# EAGLE design pmi_extension_2k13 (EAGLE 6.4)
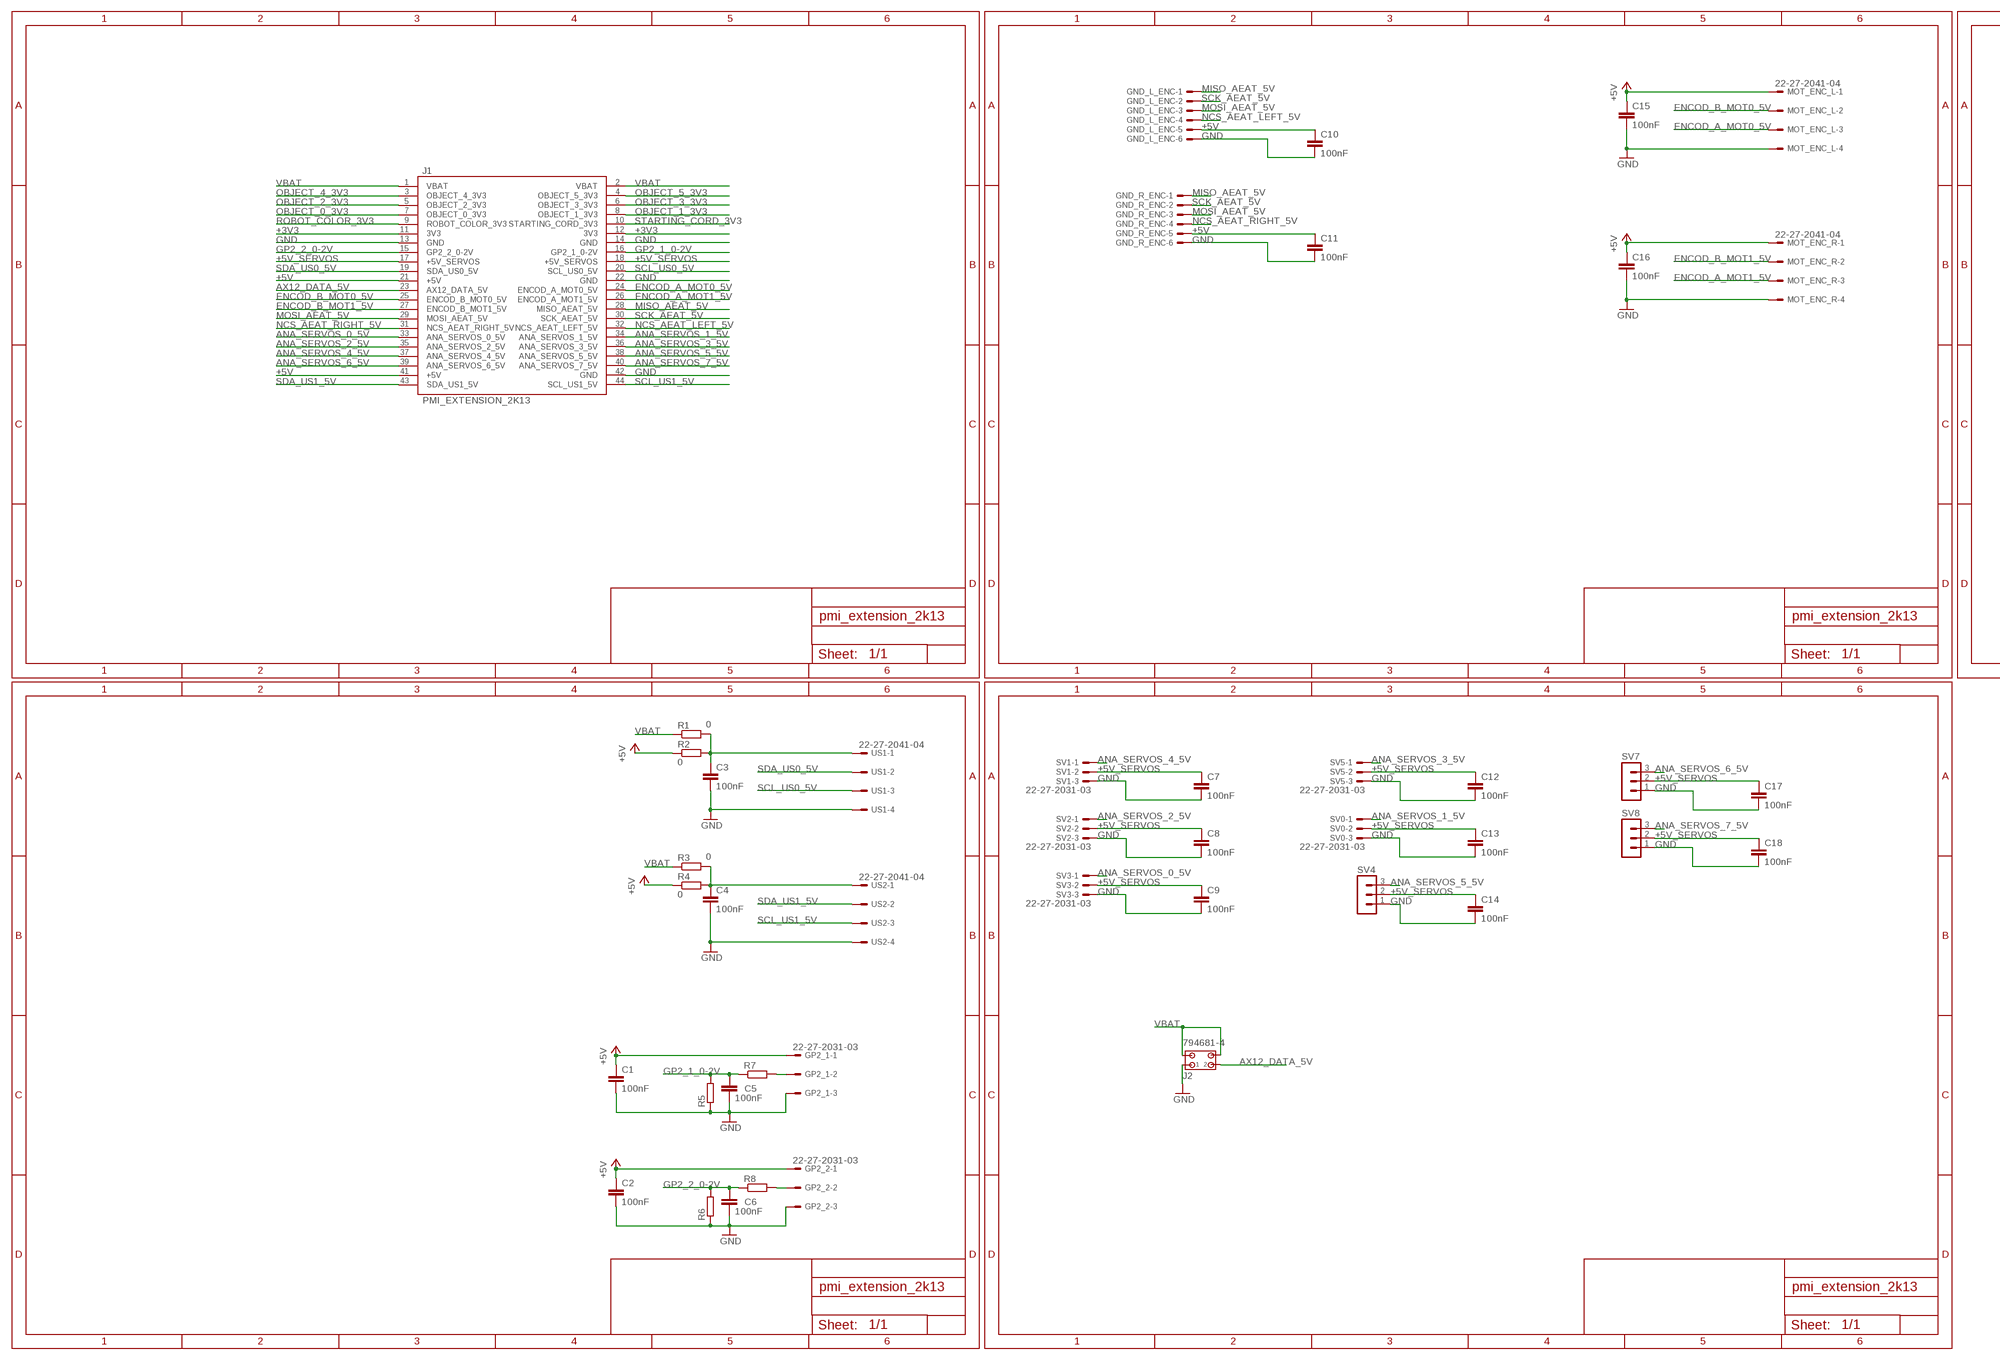
[diagram p0: schematic, sheet 1, part 1 of 2]
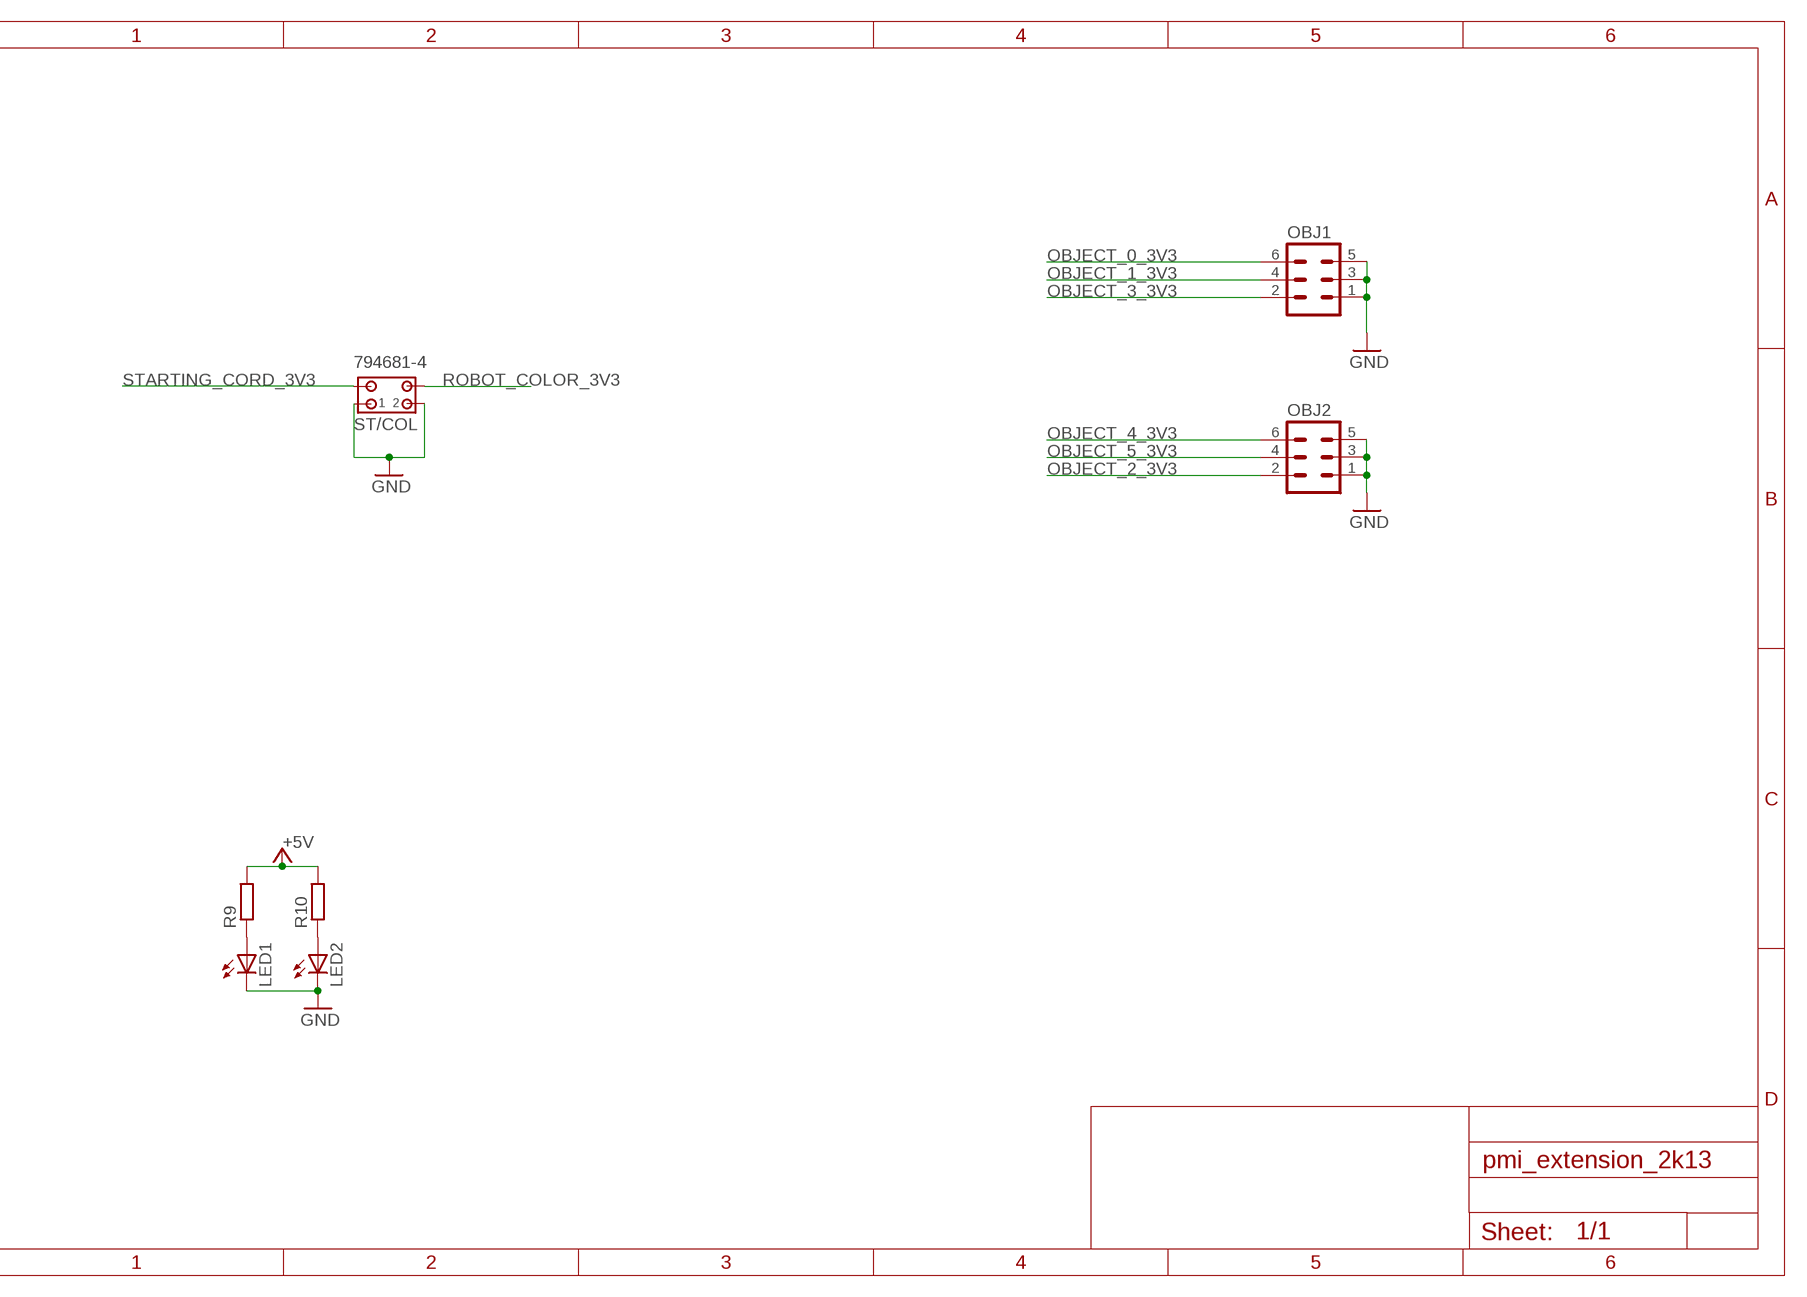
[diagram p1: schematic, sheet 1, part 2 of 2]

## Parts
C1  100nF  C-EUC0603  [C0603]
C2  100nF  C-EUC0603  [C0603]
C3  100nF  C-EUC0603  [C0603]
C4  100nF  C-EUC0603  [C0603]
C5  100nF  C-EUC0603  [C0603]
C6  100nF  C-EUC0603  [C0603]
C7  100nF  C-EUC0805  [C0805]
C8  100nF  C-EUC0805  [C0805]
C9  100nF  C-EUC0805  [C0805]
C10  100nF  C-EUC0603  [C0603]
C11  100nF  C-EUC0603  [C0603]
C12  100nF  C-EUC0805  [C0805]
C13  100nF  C-EUC0805  [C0805]
C14  100nF  C-EUC0603  [C0603]
C15  100nF  C-EUC0603  [C0603]
C16  100nF  C-EUC0603  [C0603]
C17  100nF  C-EUC0603  [C0603]
C18  100nF  C-EUC0603  [C0603]
GND_L_ENC  22-23-2061  [22-23-2061]
GND_R_ENC  22-23-2061  [22-23-2061]
GP2_1  22-27-2031-03  [6410-03]
GP2_2  22-27-2031-03  [6410-03]
J1  PMI_EXTENSION_2K13  [HEADER_2X22]
J2  794681-4  [794681-4]
LED1  LED3MM  [LED3MM]
LED2  LED3MM  [LED3MM]
MOT_ENC_L  22-27-2041-04  [6410-04]
MOT_ENC_R  22-27-2041-04  [6410-04]
OBJ1  MA03-2  [MA03-2]
OBJ2  MA03-2  [MA03-2]
R1  0  R-EU_R0603  [R0603]
R2  0  R-EU_R0603  [R0603]
R3  0  R-EU_R0603  [R0603]
R4  0  R-EU_R0603  [R0603]
R5  R-EU_R0603  [R0603]
R6  R-EU_R0603  [R0603]
R7  R-EU_R0603  [R0603]
R8  R-EU_R0603  [R0603]
R9  R-EU_R0603  [R0603]
R10  R-EU_R0603  [R0603]
ST/COL  794681-4  [794681-4]
SV0  22-27-2031-03  [6410-03]
SV1  22-27-2031-03  [6410-03]
SV2  22-27-2031-03  [6410-03]
SV3  22-27-2031-03  [6410-03]
SV4  MA03-1  [MA03-1]
SV5  22-27-2031-03  [6410-03]
SV7  MA03-1  [MA03-1]
SV8  MA03-1  [MA03-1]
US1  22-27-2041-04  [6410-04]
US2  22-27-2041-04  [6410-04]

## Nets
+3V3: J1.11(3V3) J1.12(3V3)
+5V: C1.1 C2.1 C10.1 C11.1 C15.1 C16.1 GND_L_ENC.5 GND_R_ENC.5 GP2_1.1 GP2_2.1 J1.21(+5V) J1.41(+5V) MOT_ENC_L.1 MOT_ENC_R.1 R2.1 R4.1 R9.2 R10.2
+5V_SERVOS: C7.1 C8.1 C9.1 C12.1 C13.1 C14.1 C17.1 C18.1 J1.17(+5V_SERVOS) J1.18(+5V_SERVOS) SV0.2 SV1.2 SV2.2 SV3.2 SV4.2 SV5.2 SV7.2 SV8.2
ANA_SERVOS_0_5V: J1.33(ANA_SERVOS_0_5V) SV3.1
ANA_SERVOS_1_5V: J1.34(ANA_SERVOS_1_5V) SV0.1
ANA_SERVOS_2_5V: J1.35(ANA_SERVOS_2_5V) SV2.1
ANA_SERVOS_3_5V: J1.36(ANA_SERVOS_3_5V) SV5.1
ANA_SERVOS_4_5V: J1.37(ANA_SERVOS_4_5V) SV1.1
ANA_SERVOS_5_5V: J1.38(ANA_SERVOS_5_5V) SV4.3
ANA_SERVOS_6_5V: J1.39(ANA_SERVOS_6_5V) SV7.3
ANA_SERVOS_7_5V: J1.40(ANA_SERVOS_7_5V) SV8.3
AX12_DATA_5V: J1.23(AX12_DATA_5V) J2.2
ENCOD_A_MOT0_5V: J1.24(ENCOD_A_MOT0_5V) MOT_ENC_L.3
ENCOD_A_MOT1_5V: J1.26(ENCOD_A_MOT1_5V) MOT_ENC_R.3
ENCOD_B_MOT0_5V: J1.25(ENCOD_B_MOT0_5V) MOT_ENC_L.2
ENCOD_B_MOT1_5V: J1.27(ENCOD_B_MOT1_5V) MOT_ENC_R.2
GND: C1.2 C2.2 C3.2 C4.2 C5.2 C6.2 C7.2 C8.2 C9.2 C10.2 C11.2 C12.2 C13.2 C14.2 C15.2 C16.2 C17.2 C18.2 GND_L_ENC.6 GND_R_ENC.6 GP2_1.3 GP2_2.3 J1.13(GND) J1.14(GND) J1.22(GND) J1.42(GND) J2.1 LED1.K(C) LED2.K(C) MOT_ENC_L.4 MOT_ENC_R.4 OBJ1.1 OBJ1.3 OBJ1.5 OBJ2.1 OBJ2.3 OBJ2.5 R5.1 R6.1 ST/COL.1 ST/COL.2 SV0.3 SV1.3 SV2.3 SV3.3 SV4.1 SV5.3 SV7.1 SV8.1 US1.4 US2.4
GP2_1_0-2V: C5.1 J1.16(GP2_1_0-2V) R5.2 R7.1
GP2_2_0-2V: C6.1 J1.15(GP2_2_0-2V) R6.2 R8.1
MISO_AEAT_5V: GND_L_ENC.1 GND_R_ENC.1 J1.28(MISO_AEAT_5V)
MOSI_AEAT_5V: GND_L_ENC.3 GND_R_ENC.3 J1.29(MOSI_AEAT_5V)
N$1: GP2_1.2 R7.2
N$3: GP2_2.2 R8.2
N$4: C4.1 R3.2 R4.2 US2.1
N$5: LED1.A R9.1
N$6: C3.1 R1.2 R2.2 US1.1
N$7: LED2.A R10.1
NCS_AEAT_LEFT_5V: GND_L_ENC.4 J1.32(NCS_AEAT_LEFT_5V)
NCS_AEAT_RIGHT_5V: GND_R_ENC.4 J1.31(NCS_AEAT_RIGHT_5V)
OBJECT_0_3V3: J1.7(OBJECT_0_3V3) OBJ1.6
OBJECT_1_3V3: J1.8(OBJECT_1_3V3) OBJ1.4
OBJECT_2_3V3: J1.5(OBJECT_2_3V3) OBJ2.2
OBJECT_3_3V3: J1.6(OBJECT_3_3V3) OBJ1.2
OBJECT_4_3V3: J1.3(OBJECT_4_3V3) OBJ2.6
OBJECT_5_3V3: J1.4(OBJECT_5_3V3) OBJ2.4
ROBOT_COLOR_3V3: J1.9(ROBOT_COLOR_3V3) ST/COL.4
SCK_AEAT_5V: GND_L_ENC.2 GND_R_ENC.2 J1.30(SCK_AEAT_5V)
SCL_US0_5V: J1.20(SCL_US0_5V) US1.3
SCL_US1_5V: J1.44(SCL_US1_5V) US2.3
SDA_US0_5V: J1.19(SDA_US0_5V) US1.2
SDA_US1_5V: J1.43(SDA_US1_5V) US2.2
STARTING_CORD_3V3: J1.10(STARTING_CORD_3V3) ST/COL.3
VBAT: J1.1(VBAT) J1.2(VBAT) J2.3 J2.4 R1.1 R3.1

## Library data of the parts
C1-C18 = rcl:C-EU: CAPACITOR, European symbol
GND_L_ENC GND_R_ENC = con-molex:22-23-2061: .100" (2.54mm) Center Header - 6 Pin; MF: MOLEX; MPN: 22-23-2061; OC_FARNELL: 1462922; OC_NEWARK: 27C1933
GP2_1 GP2_2 SV0 SV1-SV3 SV5 = con-molex:22-?-03: CONNECTOR wire to board 2.54 mm (.1 inch) pitch header; OC_FARNELL: unknown; OC_NEWARK: unknown
J1 = robotter_connector:PMI_EXTENSION_2K13
J2 ST/COL = con-amp:794681-4: Micro MATE-N-LOK Connectors grid 1.5mm Dual Row Through Hole Vertical Metal Through Hole Holddowns Source: ENG_CD_794681_E.pdf
LED1 LED2 = led:LED: LED OSRAM: - CHIPLED LG R971, LG N971, LY N971, LG Q971, LY Q971, LO R971, LY R971 LH N974, LH R974 LS Q976, LO Q976, LY Q976 LO Q996 - Hyper CHIPLED LW Q18S LB Q993, LB Q99A, LB R99A - SideLED LS A670, LO A670, LY A670, LG A670, LP A670 LB A673, LV A673, LT A673, LW A673 LH A674 LY A675 LS A676, LA A676, LO A676, LY A676, LW A676 LS A679, LY A679, LG A679 - Hyper Micro SIDELED® LS Y876, LA Y876, LO Y876, LY Y876 LT Y87S - SmartLED LW L88C, LW L88S LB L89C, LB L89S, LG L890 LS L89K, LO L89K, LY L89K LS L896, LA L896, LO L896, LY L896 - TOPLED LS T670, LO T670, LY T670, LG T670, LP T670 LSG T670, LSP T670, LSY T670, LOP T670, LYG T670 LG T671, LOG T671, LSG T671 LB T673, LV T673, LT T673, LW T673 LH T674 LS T676, LA T676, LO T676, LY T676, LB T676, LH T676, LSB T676, LW T676 LB T67C, LV T67C, LT T67C, LS T67K, LO T67K, LY T67K, LW E67C LS E67B, LA E67B, LO E67B, LY E67B, LB E67C, LV E67C, LT E67C LW T67C LS T679, LY T679, LG T679 LS T770, LO T770, LY T770, LG T770, LP T770 LB T773, LV T773, LT T773, LW T773 LH T774 LS E675, LA E675, LY E675, LS T675 LS T776, LA T776, LO T776, LY T776, LB T776 LHGB T686 LT T68C, LB T68C - Hyper Mini TOPLED® LB M676 - Mini TOPLED Santana® LG M470 LS M47K, LO M47K, LY M47K Source: http://www.osram.convergy.de LUXEON: - LUMILED® LXK2-PW12-R00, LXK2-PW12-S00, LXK2-PW14-U00, LXK2-PW14-V00 LXK2-PM12-R00, LXK2-PM12-S00, LXK2-PM14-U00 LXK2-PE12-Q00, LXK2-PE12-R00, LXK2-PE12-S00, LXK2-PE14-T00, LXK2-PE14-U00 LXK2-PB12-K00, LXK2-PB12-L00, LXK2-PB12-M00, LXK2-PB14-N00, LXK2-PB14-P00, LXK2-PB14-Q00 LXK2-PR12-L00, LXK2-PR12-M00, LXK2-PR14-Q00, LXK2-PR14-R00 LXK2-PD12-Q00, LXK2-PD12-R00, LXK2-PD12-S00 LXK2-PH12-R00, LXK2-PH12-S00 LXK2-PL12-P00, LXK2-PL12-Q00, LXK2-PL12-R00 Source: www.luxeon.com KINGBRIGHT: KA-3528ASYC Source: www.kingbright.com
MOT_ENC_L MOT_ENC_R US1 US2 = con-molex:22-?-04: CONNECTOR wire to board 2.54 mm (.1 inch) pitch header; OC_FARNELL: unknown; OC_NEWARK: unknown
OBJ1 OBJ2 = con-lstb:MA03-2: PIN HEADER; OC_FARNELL: unknown; OC_NEWARK: unknown
R1-R10 = rcl:R-EU_: RESISTOR, European symbol
SV4 SV7 SV8 = con-lstb:MA03-1: PIN HEADER; OC_FARNELL: unknown; OC_NEWARK: unknown

## Board
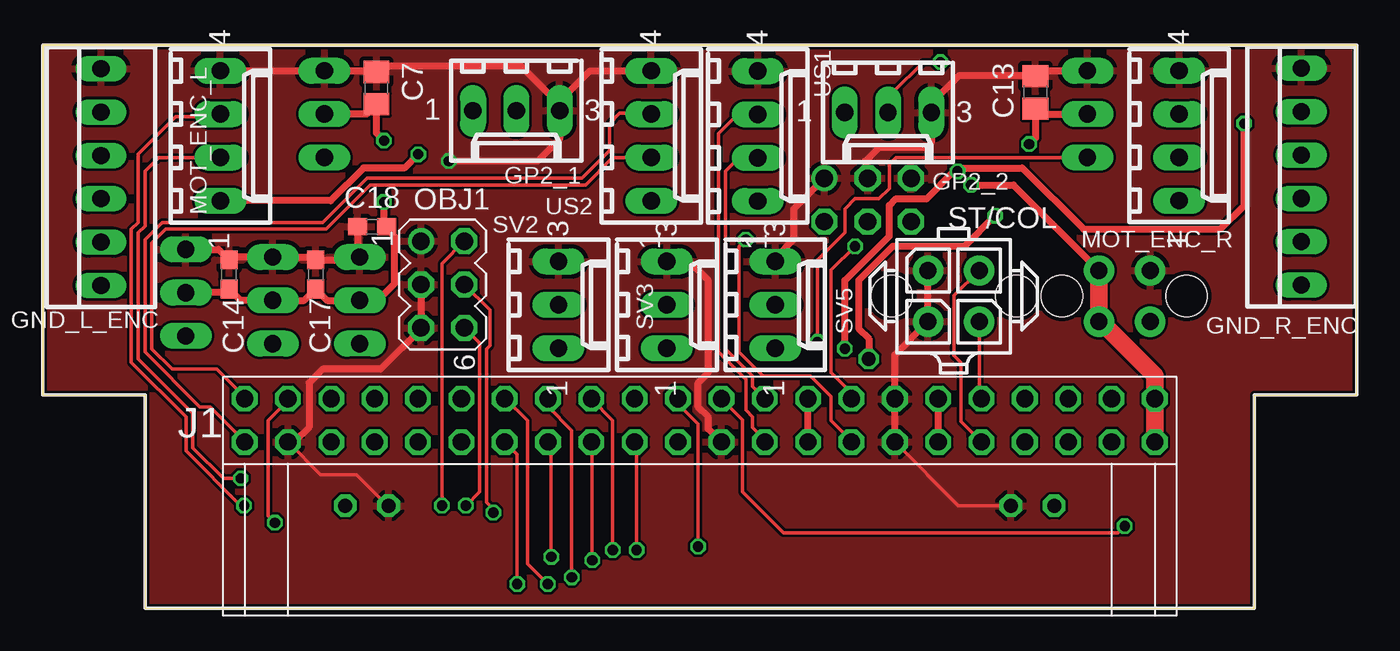
[diagram p2: board, top side]
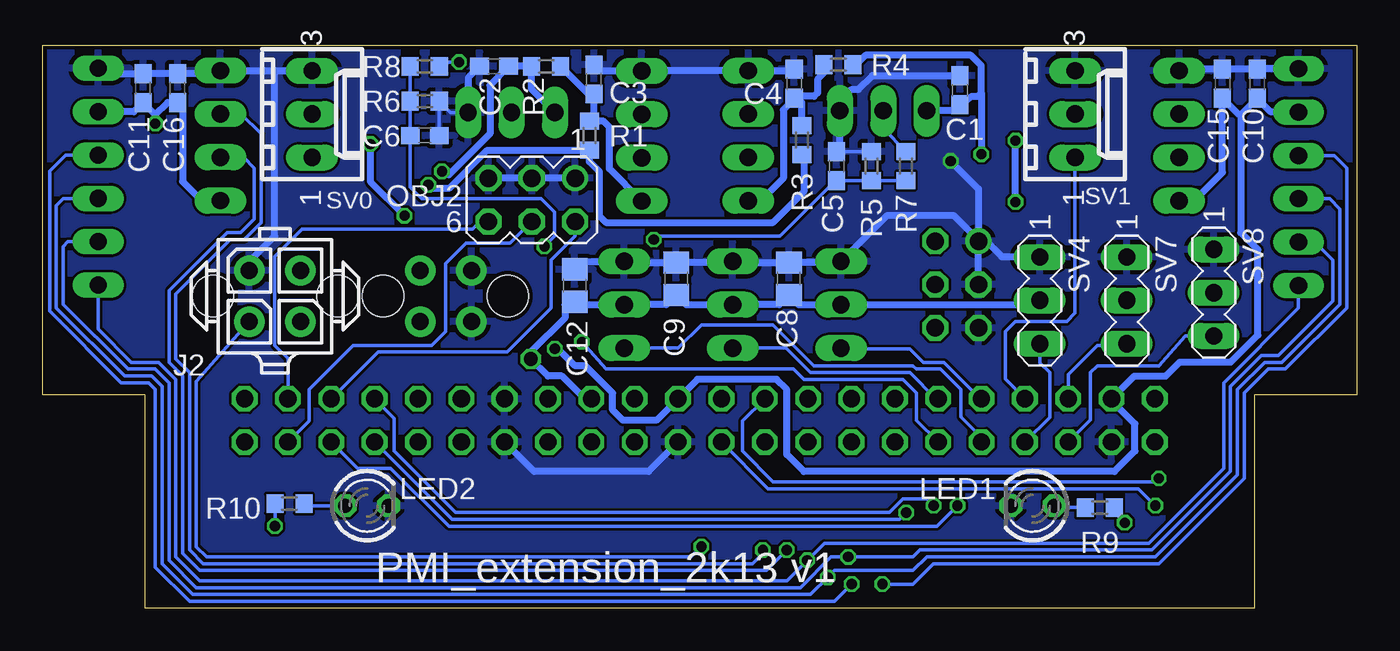
[diagram p3: board, bottom side, seen from below]

Size 77 x 33 mm. Coordinates in mm from the lower left corner, seen from the top.
Outline: 6,0 71,0 71,12.5 77,12.5 77,33 0,33 0,12.5 6,12.5 6,0
Copper layers (1*16): Top 0.035mm / dielectric 1.5mm / Bottom 0.035mm
Design rules "Fusion_eagle_rule_v1.1 *": minimum track width 6mil, minimum drill 12mil, track to track 6mil, track to pad 6mil, pad to pad 6mil, via to via 6mil, smd to smd 0mil, copper to edge 10mil, drill to drill 10mil, minimum pad ring 10mil, minimum via ring 6mil, stop-mask expansion 2mil, vias tented up to drill 100mil, thermal gap 10mil

### Footprints (pad centres in the part's own frame; a part is rotated, then mirrored left to right if it is on the bottom)
C0603 = smd 1.1 x 1: 1 -0.85,0; 2 0.85,0
C0805 = smd 1.3 x 1.5: 1 -0.95,0; 2 0.95,0
22-23-2061 = drill 1 long: 1 -6.35,0; 2 -3.81,0; 3 -1.27,0; 4 1.27,0; 5 3.81,0; 6 6.35,0
6410-03 = drill 1.016 long: 1 2.54,0; 2 0,0; 3 -2.54,0
HEADER_2X22 = drill 1 pad 1.422 octagon: 1 26.67,1.27; 2 26.67,-1.27; 3 24.13,1.27; 4 24.13,-1.27; 5 21.59,1.27; 6 21.59,-1.27; 7 19.05,1.27; 8 19.05,-1.27; 9 16.51,1.27; 10 16.51,-1.27; 11 13.97,1.27; 12 13.97,-1.27; 13 11.43,1.27; 14 11.43,-1.27; 15 8.89,1.27; 16 8.89,-1.27; 17 6.35,1.27; 18 6.35,-1.27; 19 3.81,1.27; 20 3.81,-1.27; 21 1.27,1.27; 22 1.27,-1.27; 23 -1.27,1.27; 24 -1.27,-1.27; 25 -3.81,1.27; 26 -3.81,-1.27; 27 -6.35,1.27; 28 -6.35,-1.27; 29 -8.89,1.27; 30 -8.89,-1.27; 31 -11.43,1.27; 32 -11.43,-1.27; 33 -13.97,1.27; 34 -13.97,-1.27; 35 -16.51,1.27; 36 -16.51,-1.27; 37 -19.05,1.27; 38 -19.05,-1.27; 39 -21.59,1.27; 40 -21.59,-1.27; 41 -24.13,1.27; 42 -24.13,-1.27; 43 -26.67,1.27; 44 -26.67,-1.27
794681-4 = drill 1 pad 1.778: 1 1.5,-1.5; 2 1.5,1.5; 3 -1.5,-1.5; 4 -1.5,1.5 | hole 2.4: 3.63,0; -3.67,0
LED3MM = drill 0.813 octagon: A -1.27,0; K 1.27,0
6410-04 = drill 1.016 long: 1 3.81,0; 2 1.27,0; 3 -1.27,0; 4 -3.81,0
MA03-2 = drill 1.016: 1 -2.54,-1.27 | drill 1.016 octagon: 2 -2.54,1.27; 3 0,-1.27; 4 0,1.27; 5 2.54,-1.27; 6 2.54,1.27
R0603 = smd 1 x 1.1: 1 -0.85,0; 2 0.85,0
MA03-1 = drill 1.016 long: 1 -2.54,0; 2 0,0; 3 2.54,0

### Placement (x,y rotation side)
C1  23.25,30.36 90 bottom
C2  50.55,31.75 180 bottom
C3  44.7,30.99 90 bottom
C4  32.97,30.73 90 bottom
C5  30.48,25.91 90 bottom
C6  54.61,27.69 0 bottom
C7  19.56,30.48 90 top
C8  33.27,19.3 90 bottom
C9  39.88,19.3 90 bottom
C10  5.84,30.73 90 bottom
C11  71.12,30.48 90 bottom
C12  45.83,18.9 90 bottom
C13  58.17,30.23 90 top
C14  10.92,19.56 90 top
C15  7.87,30.73 90 bottom
C16  69.09,30.48 90 bottom
C17  16,19.56 90 top
C18  19.3,22.35 180 top
GND_L_ENC  3.42,25.26 90 top
GND_R_ENC  73.75,25.28 90 top
GP2_1  27.75,29.15 180 top
GP2_2  49.53,29.05 180 top
J1  38.5,11 0 top
J2  63.39,18.29 180 bottom
LED1  19,6 180 bottom
LED2  58,6 0 bottom
MOT_ENC_L  10.41,27.69 270 top
MOT_ENC_R  66.59,27.69 270 top
OBJ1  23.43,18.97 270 top
OBJ2  48.34,23.92 180 bottom
R1  44.96,27.69 90 bottom
R2  47.5,31.75 0 bottom
R3  32.51,27.43 90 bottom
R4  30.37,31.85 180 bottom
R5  28.45,25.91 270 bottom
R6  54.61,29.72 180 bottom
R7  26.42,25.91 90 bottom
R8  54.61,31.75 0 bottom
R9  15.06,5.89 0 bottom
R10  62.54,6.12 180 bottom
ST/COL  53.38,18.29 180 top
SV0  61.21,28.96 270 bottom
SV1  16.51,28.96 270 bottom
SV2  30.23,17.78 270 top
SV3  36.58,17.78 270 top
SV4  18.57,18.03 270 bottom
SV5  42.93,17.78 270 top
SV7  13.48,18.03 270 bottom
SV8  8.38,18.49 270 bottom
US1  41.9,27.67 270 top
US2  35.66,27.69 270 top

### Tracks (layer width: path | path; a pad name or v marks a point on that pad's centre or on a via)
+3V3
  Top 0.406: J1.12 J1.11
+5V  (via drill 0.6)
  Top 0.2: v63.4,4.8 63,4.4 43.4,4.4 41,6.8 41,11.04 J1.21 | v13.6,5 13.2,5.4 13.2,11 14.37,12.17 J1.41
  Top 0.406: v47,15.2 47,19.2 49.6,21.8 49.6,23.6 50,24 51.8,24 53.4,25.6 v53.6,25.6 53.8,25.8 57.4,25.8 61,22.2 69,22.2 70.4,23.6 v70.4,28.4 | v22,26.6 21.2,25.8 18.8,25.8 16.88,23.88 MOT_ENC_L.1
  Bottom 0.2: R10.2 v63.39,4.81 v63.4,4.8 | R9.2 14.21,5.61 v13.6,5
  Bottom 0.406: GND_L_ENC.5 5.03,29.07 C10.1 6.8,28.93 | 6.8,28.93 6.8,22 5.8,21 5.8,16 7.4,14.4 10.4,14.4 11.2,13.6 13.04,13.6 J1.41 14.37,12.17 13,10.8 13,9.2 14.2,8 32.4,8 33.4,9 33.4,12.8 34,13.4 38.64,13.4 J1.21 41.04,11 43,11 43.6,11.6 43.6,12.6 45.2,14.2 45.8,14.2 46.8,15.2 v47,15.2 | 6.8,28.93 6.92,28.93 C15.1 7.87,25.53 9.52,23.88 MOT_ENC_L.1 | R4.1 29.2,32 28.8,32.4 22.6,32.4 22,31.8 22,30.2 | GP2_1.1 23.61,29.15 C1.1 22.56,30 22.2,30 22,30.2 | MOT_ENC_R.1 67.68,23.88 68.8,25 68.8,29.34 C16.1 69.68,29.63 70.4,28.91 | GND_R_ENC.5 71.66,29.09 C11.1 70.4,28.91 | GP2_2.1 48.35,30.41 R2.1 C2.1 50.8,30.65 50.8,27.8 53.2,25.4 v53.6,25.6 | 22,30.2 v22,26.6 | v70.4,28.4 70.4,28.91
+5V_SERVOS  (via drill 0.6, 0.8)
  Top 0.406: SV8.2 10.5,18.49 C14.1 11.6,18.03 SV7.2 15.33,18.03 C17.1 16.71,18 18.2,18 18.23,18.03 SV4.2 18.74,18.2 19.8,18.2 20.6,19 20.6,21.8 20.15,22.25 C18.1 20,22.51 v20,23.8 | SV1.2 18.98,28.96 C7.1 19.56,27.84 v20,27.4 | SV0.2 58.49,28.96 C13.1 58.17,27.57 v57.8,27.2 | J1.18 J1.17 | v55.8,23 54,21.2 49.8,21.2 47.8,19.2 47.8,16.4 48.4,15.8 v48.4,14.6
  Bottom 0.406: v57.8,27.2 57.8,25 v55.8,23 | J1.17 45.38,12.4 46.58,13.6 47.4,13.6 v48.4,14.6 48.4,15 46.4,17 46.4,17.78 C12.1 45.65,17.78 SV5.2 40.45,17.78 C9.1 39.3,17.78 SV3.2 33.85,17.78 C8.1 32.7,17.78 SV2.2 18.83,17.78 SV4.2 | v20,23.8 v20,27.4
ANA_SERVOS_0_5V
  Bottom 0.2: J1.33 24.67,12.27 26.2,13.8 32,13.8 33.44,15.24 SV3.1 36.54,15.2
ANA_SERVOS_1_5V  (via drill 0.6)
  Top 0.2: v45.4,15.6 45.4,20.4 47,22 47,23.4 47.6,24 49,24 49.6,24.6 49.6,26 50,26.4 60.83,26.4 61.03,26.6 SV0.1
  Bottom 0.2: J1.34 25.8,11 25.8,12.6 26.6,13.4 32.4,13.4 33,14 44,14 v45.4,15.6
ANA_SERVOS_2_5V
  Bottom 0.2: J1.35 22.07,12.27 24.2,14.4 25.4,14.4 26.2,15.2 30.19,15.2 SV2.1
ANA_SERVOS_3_5V
  Bottom 0.2: J1.36 21.99,9.99 23.2,11.2 23.2,12.8 24.4,14 25.8,14 26,14.2 31.8,14.2 34.2,16.6 38.4,16.6 39.76,15.24 40.04,15.24 41,15.24 SV5.1
ANA_SERVOS_4_5V
  Bottom 0.2: J1.37 20.6,13.42 20.6,16.2 20,16.8 17,16.8 16.51,17.29 SV1.1
ANA_SERVOS_5_5V
  Bottom 0.2: SV4.3 18.57,14.37 18,13.8 18,11.18 J1.38
ANA_SERVOS_6_5V
  Bottom 0.2: J1.39 16.91,13.69 15.2,15.4 13.57,15.4 SV7.3
ANA_SERVOS_7_5V
  Bottom 0.2: J1.40 15.6,11.04 15.6,13.8 15.2,14.2 11.6,14.2 10.05,15.95 SV8.3
AX12_DATA_5V  (via drill 0.6)
  Top 0.2: J1.23 37.2,12.24 37.2,12 38.4,10.8 v38.4,3.6
  Bottom 0.2: J2.2 68,13.28 68,3.6 67.4,3 39,3 v38.4,3.6
ENCOD_A_MOT0_5V  (via drill 0.6)
  Top 0.2: MOT_ENC_L.3 10.26,28.8 7.8,28.8 5.6,26.6 5.6,22.6 5.2,22.2 5.2,14.4 8.4,11.2 8.4,9.2 11.6,6 v11.8,6
  Bottom 0.2: v11.8,6 12.8,7 34.5,7 J1.24
ENCOD_A_MOT1_5V  (via drill 0.6)
  Top 0.2: v34.8,3.4 34.8,9.2 34.69,9.31 J1.26
  Bottom 0.2: MOT_ENC_R.3 65.36,28.96 64.2,27.8 64.2,22.6 65.2,21.6 66,21.6 69.2,18.4 69.2,14.6 68.4,13.8 68.4,3.4 67.6,2.6 35.4,2.6 34.8,3.2 v34.8,3.4
ENCOD_B_MOT0_5V  (via drill 0.6)
  Top 0.2: MOT_ENC_L.2 10.4,26.4 6.8,26.4 6,25.6 6,22.4 5.6,22 5.6,14.6 8.8,11.4 8.8,9.4 10.6,7.6 v11.6,7.6
  Bottom 0.2: v11.6,7.6 11.8,7.4 34.2,7.4 36,9.2 36,10.96 J1.25
ENCOD_B_MOT1_5V  (via drill 0.6)
  Top 0.2: v33.4,3.4 33.4,11 32.15,12.25 J1.27
  Bottom 0.2: MOT_ENC_R.2 65.22,26.42 64.6,25.8 64.6,22.8 65.4,22 66.2,22 69.6,18.6 69.6,14.4 68.8,13.6 68.8,3.2 67.8,2.2 34.6,2.2 v33.4,3.4
GND  (via drill 0.6)
  Top 0.2: LED2.K 53.66,6 J1.14 | LED1.K 20.2,6 18.4,7.8 16.3,7.8 J1.42
  Top 0.406: SV8.1 10.3,21.03 C14.2 11.09,20.57 SV7.1 15.84,20.57 C17.2 18.41,20.41 SV4.1 18.45,20.69 C18.2 | MOT_ENC_L.4 SV1.3 19.49,31.5 C7.2 19.93,31.8 28,31.8 30.29,29.51 GP2_1.3 | SV0.3 58.49,31.5 C13.2 58.14,31.2 53.67,31.2 52.07,29.6 GP2_2.3 52.07,27.27 51.8,27 49,27 48.2,26.2 48.2,25.33 OBJ2.3 | J1.14 J1.13 49.93,14.84 ST/COL.2 ST/COL.1 | US2.4 32.08,31.5 30.29,29.71 GP2_1.3 | OBJ1.3 OBJ1.5 22.16,16.36 19.8,14 16.4,14 15.6,13.2 15.6,10.6 14.73,9.73 J1.42 | GP2_1.3 30.29,27.49 29,26.2 v23.8,26.2 | OBJ2.1 44,23.39 44,21.6 42.93,20.53 SV5.3 | J1.22 39,10.5 39,11.2 38.4,11.8 38.4,13.2 39,13.8 39,19.2 37.88,20.32 SV3.3
  Bottom 0.2: R5.1 C5.2 30.29,26.95 | C6.2 R6.1 53.09,29.05 GP2_2.3
  Bottom 0.406: GND_L_ENC.6 5.81,31.61 C10.2 C15.2 10.33,31.58 MOT_ENC_L.4 | C4.2 32.85,31.5 US2.4 41.88,31.5 US1.4 44.34,31.48 C3.2 | C1.2 28.39,31.21 29.2,30.4 29.6,30.4 30.29,29.71 GP2_1.3 30.29,26.95 | GND_R_ENC.6 73.45,31.33 C11.2 C16.2 66.76,31.33 MOT_ENC_R.4 63.4,31.5 | OBJ2.1 OBJ2.3 OBJ2.5 | C2.2 52.07,31.08 GP2_2.3 | 63.4,31.5 SV0.3 | C12.2 45.36,20.32 SV5.3 42.86,20.25 C9.2 36.64,20.25 SV3.3 36.51,20.25 C8.2 30.29,20.25 SV2.3 27.55,23 23.6,23 22.16,21.56 OBJ1.1 | OBJ1.3 OBJ1.1 | OBJ1.1 21.71,21.51 20.8,20.6 18.6,20.6 SV4.1 | v23.8,26.2 22.16,24.56 OBJ1.1 | J2.1 64.89,20.31 63.4,21.8 63.4,31.5 | J1.14 48.2,8 41.5,8 J1.22
  pour Bottom: -1.5,33 78.5,33 78.5,-1.5 -1.5,-1.5
  pour Top: -1.5,33 78,33 78,-0.5 -1.5,-0.5
GP2_1_0-2V  (via drill 0.6)
  Top 0.2: v41.2,21.6 40.8,21.2 40.8,15 42.2,13.6 45,13.6 46.2,12.4 46.2,11 47.4,9.8 J1.16
  Bottom 0.2: R7.1 R5.2 C5.1 30.54,25.06 33.8,21.8 41,21.8 v41.2,21.6
GP2_2_0-2V  (via drill 0.6)
  Top 0.2: v47.6,21.2 46.2,19.8 46.2,13.8 47.39,12.61 J1.15
  Bottom 0.2: R8.1 R6.2 C6.1 55.46,24.66 54.8,24 47.8,24 47,23.2 47,21.8 v47.6,21.2
MISO_AEAT_5V  (via drill 0.6)
  Top 0.2: J1.28 32.2,9.68 v32.2,2.8
  Bottom 0.2: GND_L_ENC.1 3.42,17.58 7.8,13.2 7.8,8.2 12.2,3.8 31.2,3.8 v32.2,2.8 33.4,1.6 67.8,1.6 69.2,3 69.2,13.4 70.2,14.4 71.8,14.4 73.75,16.35 GND_R_ENC.1
MOSI_AEAT_5V  (via drill 0.6)
  Top 0.2: v31,1.8 31,10.4 29.61,11.81 J1.29
  Bottom 0.2: GND_L_ENC.3 1.59,23.99 1,23.4 1,17.8 4.4,14.4 5.4,14.4 7,12.8 7,7.8 11.8,3 25.2,3 26,2.2 27.2,2.2 27.4,2.2 30.6,2.2 v31,1.8 32,0.8 68.2,0.8 70,2.6 70,13 70.6,13.6 72.2,13.6 76.2,17.6 76.2,23.6 75.79,24.01 GND_R_ENC.3
N$1
  Bottom 0.2: GP2_1.2 27.75,28.09 R7.2
N$3  (via drill 0.6)
  Top 0.2: v52.6,32 51.6,32 49.8,30.2 49.8,29.32 GP2_2.2
  Bottom 0.2: R8.2 53.51,32 v52.6,32
N$4
  Bottom 0.406: C4.1 32.92,29.88 33.6,29.2 33.6,25.2 34.8,24 35.53,24 US2.1 | R3.2 32.51,29.63 C4.1 | R4.2 31.02,31.58 31.6,31 31.6,30.2 31.8,30 32.65,30 C4.1
N$5
  Bottom 0.2: R9.1 17.62,5.89 LED1.A
N$6
  Bottom 0.406: R2.2 45.04,30.14 C3.1 44.7,28.79 R1.2 44.14,28.54 43.8,28.2 43.8,25.75 US1.1
N$7
  Bottom 0.2: LED2.A 61.57,6 R10.1
NCS_AEAT_LEFT_5V  (via drill 0.6)
  Top 0.2: v27.8,1.4 27.8,9 J1.32
  Bottom 0.2: GND_L_ENC.4 1.33,26.53 0.6,25.8 0.6,17.6 4.2,14 5.2,14 6.6,12.6 6.6,7.6 11.6,2.6 24.8,2.6 26,1.4 v27.8,1.4
NCS_AEAT_RIGHT_5V  (via drill 0.6)
  Top 0.2: v29.6,1.4 28.4,2.6 28.4,11 27.13,12.27 J1.31
  Bottom 0.2: GND_R_ENC.4 75.65,26.55 76.6,25.6 76.6,17.4 72.4,13.2 70.8,13.2 70.4,12.8 70.4,2.4 68.4,0.4 30.6,0.4 v29.6,1.4
OBJECT_0_3V3  (via drill 0.6)
  Top 0.2: OBJ1.6 25.6,15.53 25.6,6.8 v24.8,6
  Bottom 0.2: J1.7 56.4,11.12 56.4,9.2 52.8,5.6 27.4,5.6 26.6,6.4 25.2,6.4 v24.8,6
OBJECT_1_3V3  (via drill 0.6)
  Top 0.2: OBJ1.4 26.2,17.47 26.2,15.4 26,15.2 26,6.2 26.4,5.8 v26.4,5.6
  Bottom 0.2: 57.6,9.68 J1.8 55.22,7.4 55.2,7.4 53,5.2 26.8,5.2 v26.4,5.6
OBJECT_2_3V3
  Bottom 0.2: J1.5 57.36,15 49.8,15 47.2,17.6 47.2,20.4 45.8,21.8 OBJ2.2
OBJECT_3_3V3  (via drill 0.6)
  Top 0.2: OBJ1.2 23.4,20.2 v23.4,6
  Bottom 0.2: v23.4,6 24.6,4.8 53.2,4.8 56.6,8.2 58.56,8.2 J1.6
OBJECT_4_3V3
  Bottom 0.2: OBJ2.6 51.03,22.8 51.2,22.8 51.8,22.2 61.8,22.2 63.4,20.6 63.4,15.4 62.63,14.63 J1.3
OBJECT_5_3V3
  Bottom 0.2: J1.4 61.4,10.96 61.4,12.8 58.8,15.4 54.2,15.4 53.4,16.2 53.4,20.2 52.2,21.4 49.6,21.4 49,22 48.99,22 OBJ2.4
ROBOT_COLOR_3V3
  Top 0.2: ST/COL.4 54.88,12.92 55,12.6 J1.9
SCK_AEAT_5V  (via drill 0.6)
  Top 0.2: J1.30 29.8,9.54 v29.8,3
  Bottom 0.2: GND_L_ENC.2 2.45,21.45 1.4,20.4 1.4,18 4.6,14.8 5.6,14.8 7.4,13 7.4,8 12,3.4 25.6,3.4 26,3 v29.8,3 30.8,3 32.6,1.2 68,1.2 69.6,2.8 69.6,13.2 70.4,14 72,14 75.8,17.8 75.8,21.2 75.53,21.47 GND_R_ENC.2
SCL_US0_5V
  Top 0.2: US1.3 41.77,28.8 40.6,28.8 39.6,27.8 39.6,15 41.2,13.4 41.2,11.6 41.6,11.2 41.6,10.6 42.31,9.89 J1.20
SCL_US1_5V
  Top 0.2: J1.44 11.83,9.77 9.8,11.8 9.2,11.8 6,15 6,21.6 7,22.6 16.4,22.6 19,25.2 31.6,25.2 33.2,26.8 33.2,28.4 33.8,29 35.61,29 US2.3
SDA_US0_5V
  Top 0.2: US1.2 40.8,26.4 40,25.6 40,15.2 41.6,13.6 41.6,12.98 J1.19
SDA_US1_5V
  Top 0.2: J1.43 11.83,12.37 10.2,14 7.6,14 6.4,15.2 6.4,21.4 7.2,22.2 16.6,22.2 19.2,24.8 31.8,24.8 33.4,26.4 35.64,26.4 US2.2
STARTING_CORD_3V3
  Top 0.2: J1.10 53.8,10.94 53.8,14.4 53.4,14.8 53.4,18.31 ST/COL.3
VBAT  (via drill 0.6)
  Top 0.406: v54.4,24.8 56.88,24.8 J2.3
  Top 1.016: 61.89,16.91 65.17,13.63 J1.1 J1.2 | J2.4 61.89,16.91 | 61.89,16.91 J2.3
  Bottom 0.406: R3.1 32.4,26.47 32.4,24.4 34.2,22.6 44,22.6 44.4,23 44.4,25.6 44.96,26.16 R1.1 44.99,26.8 51,26.8 53.2,24.6 54.2,24.6 v54.4,24.8

### Text on the board
bNames: PMI_extension_2k13 v1